# EAGLE design OSIVE IMS (EAGLE 9.0.1)
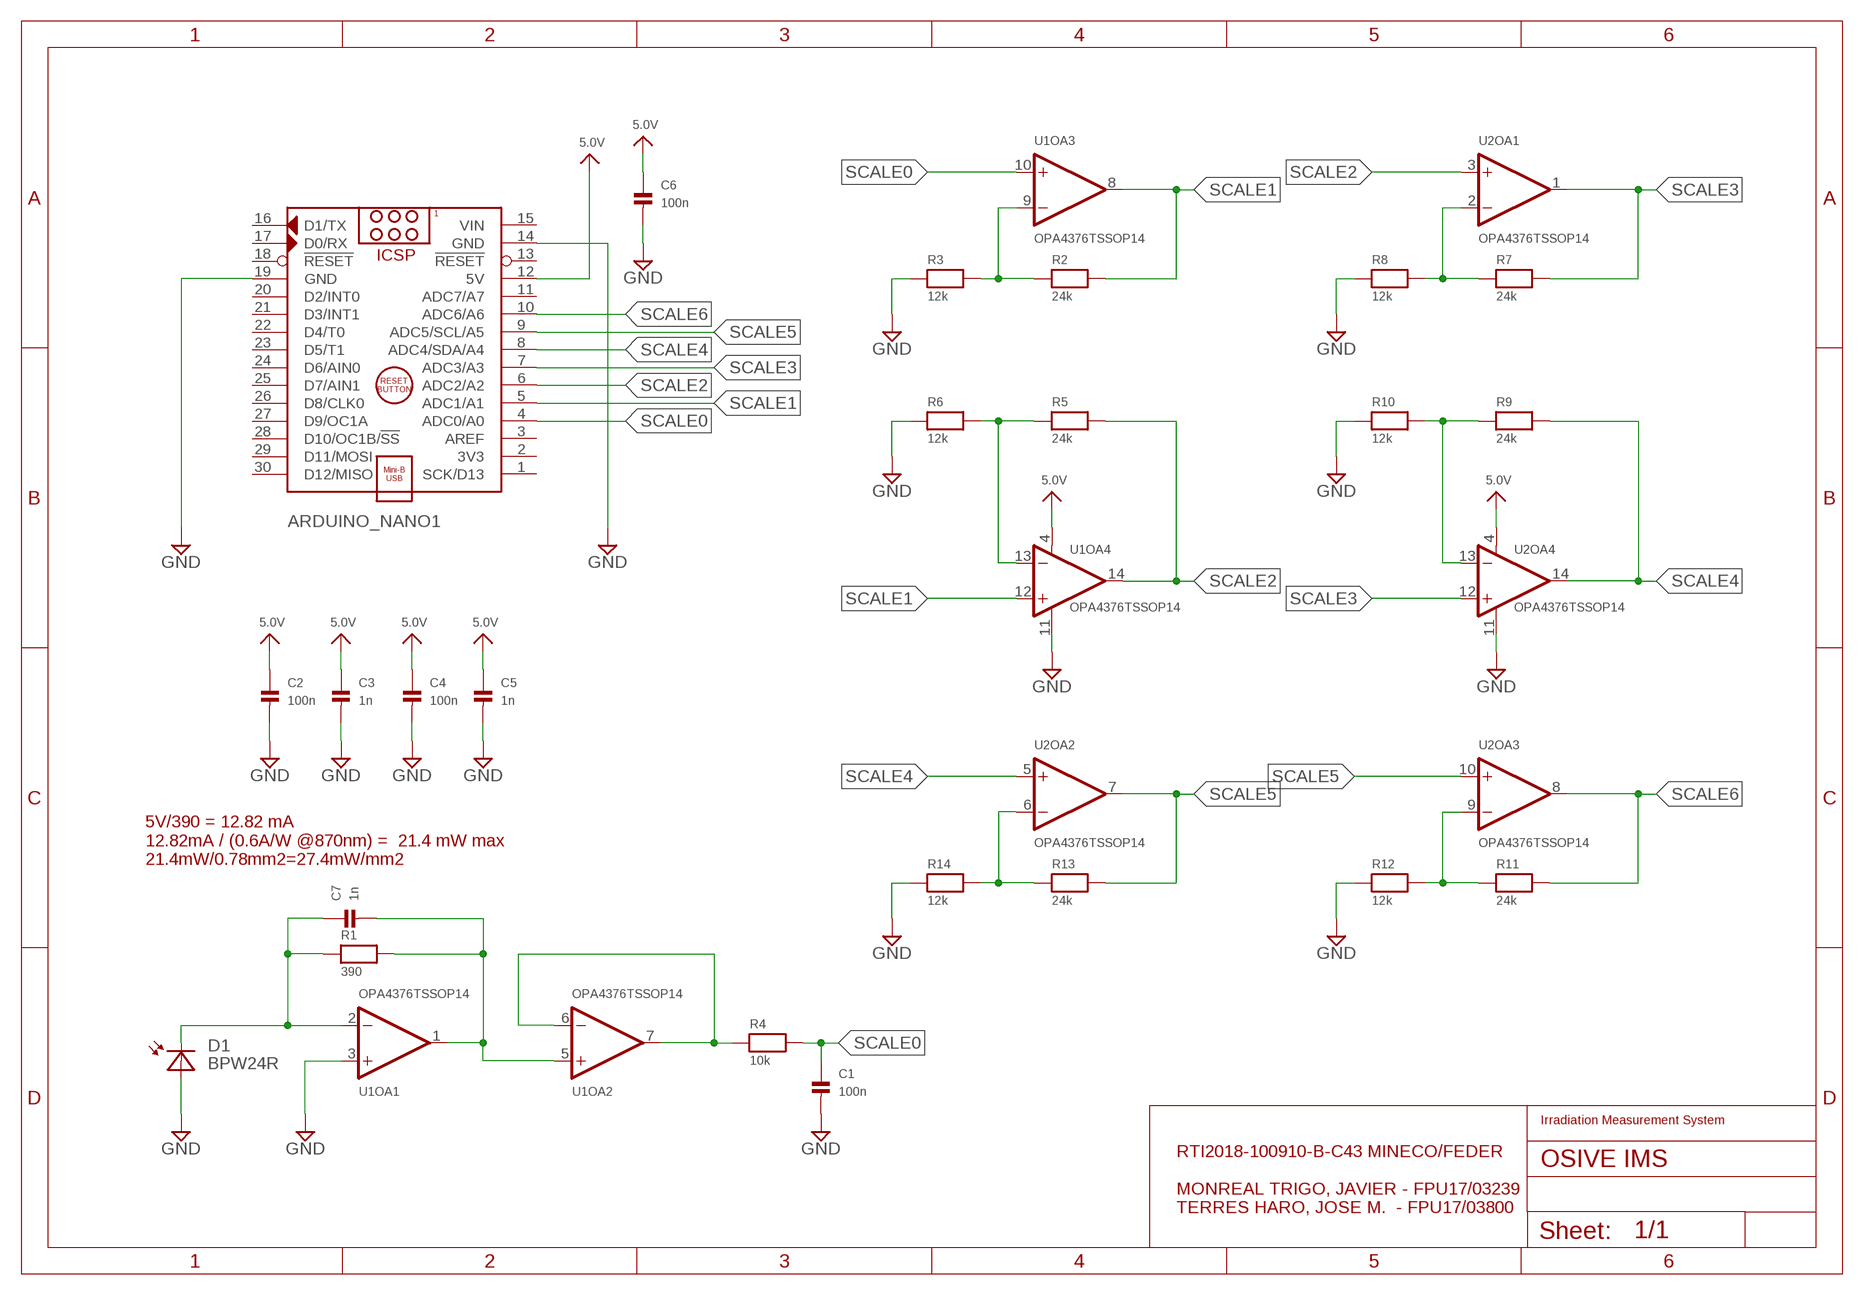
[diagram p0: schematic, sheet 1]

## Parts
ARDUINO_NANO1  ARDUINO_NANO  [ARDUINO_NANO]
C1  100n  CAP_CERAMIC0805  [0805]
C2  100n  CAP_CERAMIC0805  [0805]
C3  1n  CAP_CERAMIC0805  [0805]
C4  100n  CAP_CERAMIC0805  [0805]
C5  1n  CAP_CERAMIC0805  [0805]
C6  100n  CAP_CERAMIC0805  [0805]
C7  1n  CAP_CERAMIC0805  [0805]
D1  BPW24R  [TO-18]
R1  390  RESISTOR0805  [0805]
R2  24k  RESISTOR0805  [0805]
R3  12k  RESISTOR0805  [0805]
R4  10k  RESISTOR0805  [0805]
R5  24k  RESISTOR0805  [0805]
R6  12k  RESISTOR0805  [0805]
R7  24k  RESISTOR0805  [0805]
R8  12k  RESISTOR0805  [0805]
R9  24k  RESISTOR0805  [0805]
R10  12k  RESISTOR0805  [0805]
R11  24k  RESISTOR0805  [0805]
R12  12k  RESISTOR0805  [0805]
R13  24k  RESISTOR0805  [0805]
R14  12k  RESISTOR0805  [0805]
U1  OPA4376TSSOP14  [TSSOP14-NOTHERMALPAD]
U2  OPA4376TSSOP14  [TSSOP14-NOTHERMALPAD]

## Nets
5.0V: ARDUINO_NANO1.12(5V) C2.1 C3.1 C4.1 C5.1 C6.1 U1.4(OA4:V+) U2.4(OA4:V+)
DSNFOJW: R4.1 U1.6(OA2:-IN) U1.7(OA2:OUT)
GND: ARDUINO_NANO1.14(GND) ARDUINO_NANO1.19(GND) C1.2 C2.2 C3.2 C4.2 C5.2 C6.2 D1.A R3.1 R6.1 R8.1 R10.1 R12.1 R14.1 U1.3(OA1:+IN) U1.11(OA4:V-) U2.11(OA4:V-)
N$1: C7.1 D1.K(C) R1.1 U1.2(OA1:-IN)
N$2: R2.1 R3.2 U1.9(OA3:-IN)
N$3: C7.2 R1.2 U1.1(OA1:OUT) U1.5(OA2:+IN)
N$4: R7.1 R8.2 U2.2(OA1:-IN)
N$5: R5.1 R6.2 U1.13(OA4:-IN)
N$6: R9.1 R10.2 U2.13(OA4:-IN)
N$7: R11.1 R12.2 U2.9(OA3:-IN)
N$8: R13.1 R14.2 U2.6(OA2:-IN)
SCALE0: ARDUINO_NANO1.4(ADC0/A0) C1.1 R4.2 U1.10(OA3:+IN)
SCALE1: ARDUINO_NANO1.5(ADC1/A1) R2.2 U1.8(OA3:OUT) U1.12(OA4:+IN)
SCALE2: ARDUINO_NANO1.6(ADC2/A2) R5.2 U1.14(OA4:OUT) U2.3(OA1:+IN)
SCALE3: ARDUINO_NANO1.7(ADC3/A3) R7.2 U2.1(OA1:OUT) U2.12(OA4:+IN)
SCALE4: ARDUINO_NANO1.8(ADC4/SDA/A4) R9.2 U2.5(OA2:+IN) U2.14(OA4:OUT)
SCALE5: ARDUINO_NANO1.9(ADC5/SCL/A5) R13.2 U2.7(OA2:OUT) U2.10(OA3:+IN)
SCALE6: ARDUINO_NANO1.10(ADC6/A6) R11.2 U2.8(OA3:OUT)
Unconnected: ARDUINO_NANO1.1(SCK/D13) ARDUINO_NANO1.2(3V3) ARDUINO_NANO1.3(AREF) ARDUINO_NANO1.11(ADC7/A7) ARDUINO_NANO1.13(!RESET) ARDUINO_NANO1.16(D1/TX) ARDUINO_NANO1.17(D0/RX) ARDUINO_NANO1.18(!RESET) ARDUINO_NANO1.20(D2/INT0) ARDUINO_NANO1.21(D3/INT1) ARDUINO_NANO1.22(D4/T0) ARDUINO_NANO1.23(D5/T1) ARDUINO_NANO1.24(D6/AIN0) ARDUINO_NANO1.25(D7/AIN1) ARDUINO_NANO1.26(D8/CLK0) ARDUINO_NANO1.27(D9/OC1A) ARDUINO_NANO1.28(D10/OC1B/!SS) ARDUINO_NANO1.29(D11/MOSI) ARDUINO_NANO1.30(D12/MISO)

## Notes on the sheet
- 5V/390 = 12.82 mA
  12.82mA / (0.6A/W @870nm) =  21.4 mW max
  21.4mW/0.78mm2=27.4mW/mm2
- Irradiation Measurement System
- RTI2018-100910-B-C43 MINECO/FEDER
  
  MONREAL TRIGO, JAVIER - FPU17/03239
  TERRES HARO, JOSE M.  - FPU17/03800

## Power pins joined to a net without a drawn wire
VIN: ARDUINO_NANO1.15(VIN)

## Library data of the parts
ARDUINO_NANO1 = IrradianceMeasurement:ARDUINO_NANO: Arduino Nano V3.0 Module Overview: The Arduino Nano is a small, complete, and breadboard-friendly board based on the ATmega328 (Arduino Nano 3.x) or ATmega168 (Arduino Nano 2.x). It has more or less the same functionality of the Arduino Duemilanove, but in a different package. It lacks only a DC power jack, and works with a Mini-B USB cable instead of a standard one. The Nano was designed and is being produced by Gravitech <http://www.gravitech.us/arna30wiatp.html>. General specifications: Item Value Microcontroller Atmel ATmega168 or ATmega328 Operating Voltage (logic level) 5 V Input Voltage (recommended) 7-12 V Input Voltage (limits) 6-20 V Digital I/O Pins 14 (of which 6 provide PWM output) Analog Input Pins 8 DC Current per I/O Pin 40 mA Flash Memory 16 KB (ATmega168) or 32 KB (ATmega328) of which 2 KB used by bootloader SRAM 1 KB (ATmega168) or 2 KB (ATmega328) EEPROM 512 bytes (ATmega168) or 1 KB (ATmega328) Clock Speed 16 MHz Dimensions (Inches) 0.73" x 1.70" Dimensions (mm) 18mm x 45mm Overall height About 9 mm (not including pins) Weigth 5 g Power: The Arduino Nano can be powered via the Mini-B USB connection, 6-20V unregulated external power supply (pin 30), or 5V regulated external power supply (pin 27). The power source is automatically selected to the highest voltage source. Memory: The ATmega168 has 16 KB of flash memory for storing code (of which 2 KB is used for the bootloader); the ATmega328 has 32 KB, (also with 2 KB used for the bootloader). The ATmega168 has 1 KB of SRAM and 512 bytes of EEPROM (which can be read and written with the EEPROM library); the ATmega328 has 2 KB of SRAM and 1 KB of EEPROM. Input and Output: Each of the 14 digital pins on the Nano can be used as an input or output, using pinMode(), digitalWrite(), and digitalRead() functions. They operate at 5 volts. Each pin can provide or receive a maximum of 40 mA and has an internal pull-up resistor (disconnected by default) of 20-50 kOhms. In addition, some pins have specialized functions. Visit Arduino - ArduinoBoardNano <https://www.arduino.cc/en/Main/ArduinoBoardNano>
C1-C7 = microbuilder:CAP_CERAMIC: Ceramic Capacitors 0402 - 0402 Surface Mount Capacitors 16pF 50V 5% [Digikey: 445-4899-2-ND] 18pF 50V 5% [Digikey: 490-1281-2-ND] 22pF 50V 5% [Digikey: 490-1283-2-ND] 68pF 50V 5% [Digikey: 490-1289-2-ND] 0.1uF 10V 10% [Digikey: 490-1318-2-ND] 1.0uF 6.3V 10% [Digikey: 490-1320-2-ND] 0603 - 0603 Surface Mount Capacitors 16 pF 50V 5% [Digikey: 445-5051-2-ND] 22 pF 50V [Digikey: PCC220ACVTR-ND] 33 pF 50V 5% [Digikey: 490-1415-1-ND] 56pF 50V 5% [Digikey: 490-1421-1-ND] 220pF 50V 5% [Digikey: 445-1285-1-ND] 680 pF 50V 2200 pF 50V 5% C0G [Digikey: 445-1297-1-ND] 5600 pF 100V 5% X7R [Digikey: 478-3711-1-ND] 0.1 µF 25V 10% [Digikey: PCC2277TR-ND] 0.22 µF 16V 10% X7R [Digikey: 445-1318-1-ND] 1.0 µF 25V 10% [Digikey: 445-5146-2-ND] 0603 - RF Specific 3pF 250V +/-0.1pF RF [Digikey: 712-1347-1-ND] 18 pF 250V 5% [Digikey: 478-3505-1-ND or 712-1322-1-ND] 56 pF 250V 5% C0G RF [Digikey: 490-4867-1-ND] 68 pF 250V RF [Digikey: 490-4868-1-ND] 0805 - 0805 Surface Mount Capacitors 220 pF 250V 2% RF Ceramic Capacitor [Digikey: 712-1398-1-ND] 1000 pF 50V 2% NP0 Ceramic Capacitor [Digikey: 478-3760-1-ND] 0.1 µF 25V 10% Ceramic Capacitor [Digikey: PCC1828TR-ND] 1.0 µF 16V 10% Ceramic Capacitor[Digikey: 490-1691-2-ND] 10.0 µF 10V 10% Ceramic Capacitor[Digikey: 709-1228-1-ND] 10.0 uF 16V 10% Ceramic Capacitor [Digikey: 478-5165-2-ND] 47 uF 6.3V 20% Ceramic Capacitor [Digikey: 587-1779-1-ND or 399-5506-1-ND] 1206 - 1206 Surface Mount Capacitors 47uF 10V 20% Ceramic Capacitor [Digikey: 490-5528-1-ND or 399-5508-1-ND or 445-6010-1-ND] 100uF 6.3V -20%, +80% Y5V Ceramic Capacitor (Digikey: 490-4512-1-ND, Mouser: 81-GRM31CF50J107ZE1L)
D1 = IrradianceMeasurement:BPW24R
R1-R14 = microbuilder:RESISTOR: Resistors 0402 - 0402 Surface Mount Package 22 Ohm 1% 1/16W [Digikey: 311-22.0LRTR-ND] 33 Ohm 5% 1/16W 1.0K 5% 1/16W 1.5K 5% 1/16W 2.0K 1% 1/16W 10.0K 1% 1/16W [Digikey: 311-10.0KLRTR-ND] 10.0K 5% 1/16W [Digikey: RMCF0402JT10K0TR-ND] 12.1K 1% 1/16W [Digikey: 311-22.0LRTR-ND] 100.0K 5% 1/16W 0603 - 0603 Surface Mount Package 0 Ohm 1/10 Watt 1% Resistor 15 Ohm 1/10 Watt 1% Resistor 33 Ohm 1/10 Watt 1% Resistor 49.9 Ohm 1/10 Watt 1% Resistor 100 Ohm 1/10 Watt 1% Resistor 150 Ohm 1/10 Watt 1% Resistor 240 Ohm 1/10 Watt 1% Resistor 390 Ohm 1/10 Watt 1% Resistor 560 Ohm 1/10 Watt 1% Resistor 680 Ohm 1/10 Watt 1% Resistor 750 Ohm 1/10 Watt 1% Resistor 1.0K Ohm 1/10 Watt 1% Resistor 1.5K Ohm 1/10 Watt 1% Resistor 2.0K Ohm 1/10 Watt 1% Resistor 2.2K Ohm 1/10 Watt 1% Resistor 3.3K Ohm 1/10 Watt 1% Resistor 4.7K Ohm 1/10 Watt 1% Resistor 10.0K Ohm 1/10 Watt 1% Resistor 12.0K Ohm 1/10 Watt 1% Resistor 12.1K Ohm 1/10 Watt 1% Resistor 20.0K Ohm 1/10 Watt 1% Resistor 33.0K Ohm 1/10 Watt 1% Resistor 100.0K Ohm 1/10 Watt 1% Resistor 0805 - 0805 Surface Mount Package 0 Ohm 1/8 Watt 1% Resistor 33 Ohm 1/8 Watt 1% Resistor 100 Ohm 1/8 Watt 1% Resistor 150 Ohm 1/8 Watt 1% Resistor 200 Ohm 1/8 Watt 1% Resistor 240 Ohm 1/8 Watt 1% Resistor 330 Ohm 1/8 Watt 1% Resistor 390 Ohm 1/8 Watt 1% Resistor 470 Ohm 1/8 Watt 1% Resistor 1.0K Ohm 1/8 Watt 1% Resistor 1.5K Ohm 1/8 Watt 1% Resistor 2.0K Ohm 1/8 Watt 1% Resistor 4.7K Ohm 1/8 Watt 1% Resistor 5.1K Ohm 1/8 Watt 1% Resistor 5.6K Ohm 1/8 Watt 1% Resistor 10.0K Ohm 1/8 Watt 1% Resistor 22.0K Ohm 1/8 Watt 1% Resistor 33.0K Ohm 1/8 Watt 1% Resistor 100K Ohm 1/8 Watt 1% Resistor 1206 - 1206 Surface Mount Package 2012 - 2010 Surface Mount Package 0.11 Ohm 1/2 Watt 1% Resistor - Digikey: RHM.11UCT-ND
U1 U2 = IrradianceMeasurement:OPA4376

## Board
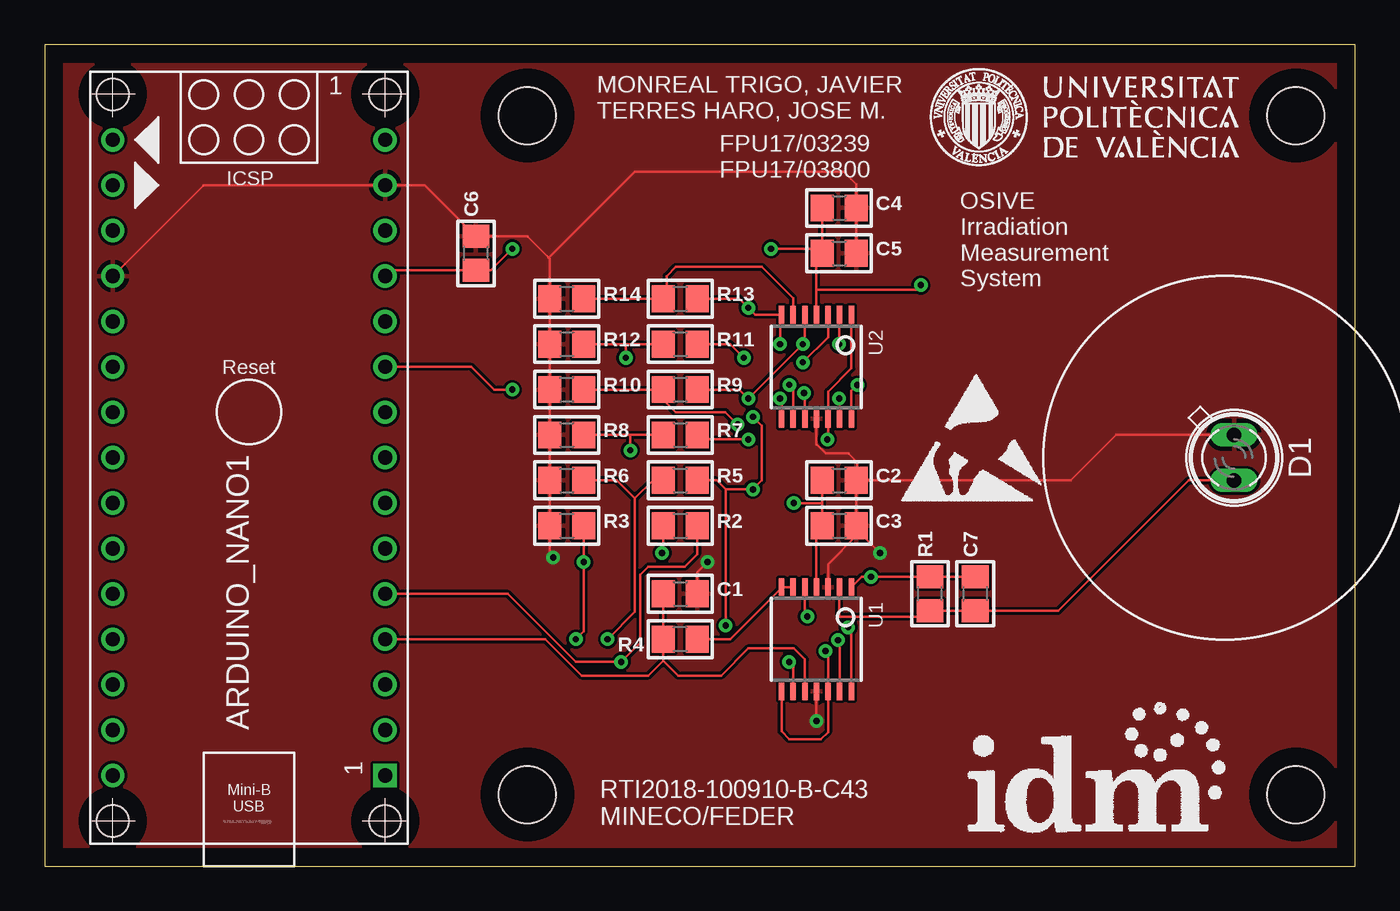
[diagram p1: board, top side]
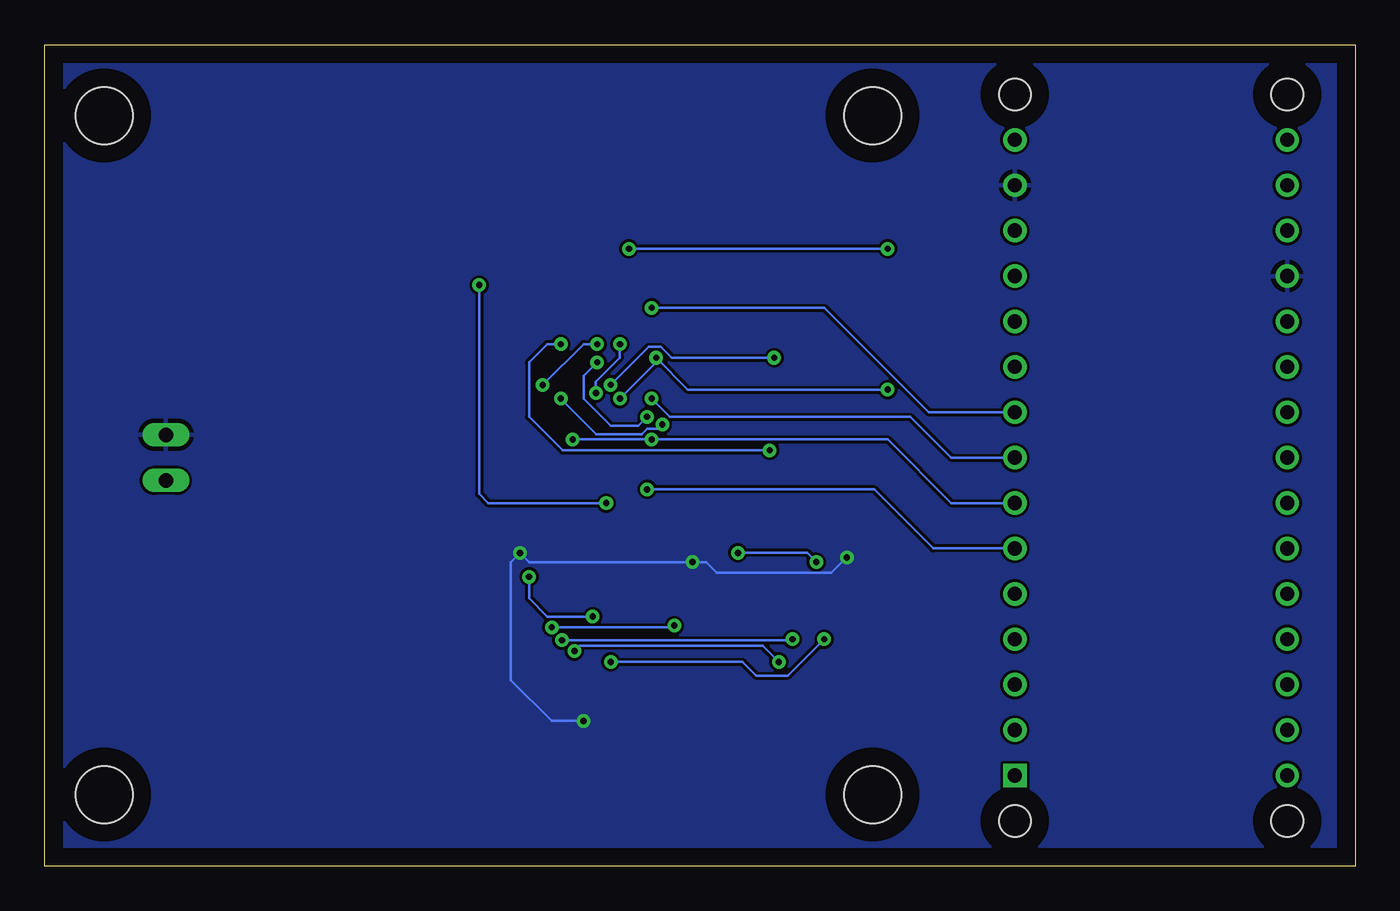
[diagram p2: board, bottom side, seen from below]

Size 73.33 x 45.96 mm. Coordinates in mm from the lower left corner, seen from the top.
Outline: 0,0 73.33,0 73.33,45.96 0,45.96 0,0
Copper layers (1*16): Top 0.035mm / dielectric 1.5mm / Bottom 0.035mm
Design rules "default": minimum track width 6mil, minimum drill 0.35mm, track to track 6mil, track to pad 6mil, pad to pad 6mil, via to via 6mil, smd to smd 6mil, copper to edge 40mil, drill to drill 6mil, minimum pad ring 10mil, minimum via ring 8mil, stop-mask expansion 4mil, vias tented up to drill 0mil, thermal gap 10mil
Holes 3.2 mm at 27,4 27,42 70,42 70,4

### Footprints (pad centres in the part's own frame; a part is rotated, then mirrored left to right if it is on the bottom)
ARDUINO_NANO = drill 0.8 square: 1 -20.32,-7.62 | drill 0.8: 2 -17.78,-7.62; 3 -15.24,-7.62; 4 -12.7,-7.62; 5 -10.16,-7.62; 6 -7.62,-7.62; 7 -5.08,-7.62; 8 -2.54,-7.62; 9 0,-7.62; 10 2.54,-7.62; 11 5.08,-7.62; 12 7.62,-7.62; 13 10.16,-7.62; 14 12.7,-7.62; 15 15.24,-7.62; 16 15.24,7.62; 17 12.7,7.62; 18 10.16,7.62; 19 7.62,7.62; 20 5.08,7.62; 21 2.54,7.62; 22 0,7.62; 23 -2.54,7.62; 24 -5.08,7.62; 25 -7.62,7.62; 26 -10.16,7.62; 27 -12.7,7.62; 28 -15.24,7.62; 29 -17.78,7.62; 30 -20.32,7.62 | hole 1.778: -22.86,-7.62; -22.86,7.62; 17.78,7.62; 17.78,-7.62
0805 = smd 1.3 x 1.5: 1 -0.95,0; 2 0.95,0
TO-18 = drill 0.813 long: A -1.27,0; K 1.27,0
TSSOP14-NOTHERMALPAD = smd 0.305 x 0.991: 1 -1.95,-2.918; 2 -1.3,-2.918; 3 -0.65,-2.918; 4 0,-2.918; 5 0.65,-2.918; 6 1.3,-2.918; 7 1.95,-2.918; 8 1.95,2.918; 9 1.3,2.918; 10 0.65,2.918; 11 0,2.918; 12 -0.65,2.918; 13 -1.3,2.918; 14 -1.95,2.918

### Placement (x,y rotation side)
ARDUINO_NANO1  11.43,25.4 90 top
C1  35.56,15.24 0 top
C2  44.45,21.59 0 top
C3  44.45,19.05 0 top
C4  44.45,36.83 0 top
C5  44.45,34.29 0 top
C6  24.13,34.29 90 top
C7  52.07,15.24 90 top
D1  66.55,22.86 270 top
R1  49.53,15.24 90 top
R2  35.56,19.05 0 top
R3  29.21,19.05 0 top
R4  35.56,12.7 180 top
R5  35.56,21.59 0 top
R6  29.21,21.59 0 top
R7  35.56,24.13 0 top
R8  29.21,24.13 0 top
R9  35.56,26.67 0 top
R10  29.21,26.67 0 top
R11  35.56,29.21 0 top
R12  29.21,29.21 0 top
R13  35.56,31.75 0 top
R14  29.21,31.75 0 top
U1  43.18,12.7 180 top
U2  43.18,27.94 180 top

### Tracks (layer width: path | path; a pad name or v marks a point on that pad's centre or on a via)
5.0V  (via drill 0.35)
  Top 0.152: U1.4 43.18,18.73 C3.1 43.5,20.32 | 43.5,20.32 C2.1 | ARDUINO_NANO1.12 19.37,33.34 C6.1 24.96,33.34 v26.16,34.54 | v40.64,34.54 43.25,34.54 C5.1 | C5.1 C4.1 | U2.4 43.18,32.26 | 43.18,32.26 43.18,33.97 C5.1 | 43.18,32.26 48.77,32.26 v49.02,32.51 | v41.91,20.32 43.5,20.32
  Bottom 0.152: v26.16,34.54 v40.64,34.54 | v49.02,32.51 49.02,20.83 48.51,20.32 v41.91,20.32
DSNFOJW
  Top 0.152: R4.1 38.35,12.7 41.15,15.49 41.23,15.58 | 41.23,15.58 U1.7 | 41.23,15.58 41.27,15.62 U1.6
GND  (via drill 0.35)
  Top 0.152: 45.4,18.8 C3.2 C2.2 45.47,21.59 | 45.4,18.8 45.4,18.48 43.83,16.91 U1.3 | 45.47,21.59 57.4,21.59 59.94,24.13 D1.A | U1.11 v43.18,8.13 | v46.74,17.53 45.47,18.8 45.4,18.8 | v37.08,17.02 36.51,16.44 C1.2 | v28.45,17.27 28.26,17.46 R3.1 R6.1 R8.1 R10.1 R12.1 | 28.19,29.72 28.26,29.65 R12.1 | R12.1 R14.1 28.26,33.97 28.19,34.04 | ARDUINO_NANO1.19 8.89,38.1 ARDUINO_NANO1.14 21.27,38.1 C6.2 26.99,35.24 28.19,34.04 | C5.2 C4.2 45.4,38.17 44.7,38.86 33.02,38.86 28.19,34.04 | U2.11 43.18,23.62 43.69,23.11 44.96,23.11 45.47,22.61 45.47,21.59
  Bottom 0.152: v43.18,8.13 44.96,8.13 47.24,10.41 47.24,17.02 v46.74,17.53 46.23,17.02 v37.08,17.02 36.32,17.02 35.72,16.41 29.31,16.41 v28.45,17.27
  pour Top: 0.25,45.97 73.41,45.97 73.41,0 0.25,0 0,-0.25 0,45.97
  pour Bottom: 0,45.97 0,0 73.41,0 73.41,45.97
N$1
  Top 0.152: U1.2 44.45,15.59 44.45,13.97 49.21,13.97 R1.1 C7.1 56.71,14.29 64.01,21.59 D1.K
N$2  (via drill 0.35)
  Top 0.152: U1.9 41.88,11.21 v41.66,11.43 | v29.72,12.7 30.16,13.14 v30.16,17.02 R3.2 | v34.54,17.53 34.61,17.59 R2.1
  Bottom 0.152: v41.66,11.43 34.29,11.43 33.53,10.67 31.75,10.67 v29.72,12.7 | v30.16,17.02 30.67,17.53 v34.54,17.53
N$3  (via drill 0.35)
  Top 0.152: U1.1 45.7,16.19 v46.23,16.19 R1.2 C7.2 | U1.5 42.53,14.11 v42.67,13.97
  Bottom 0.152: v46.23,16.19 46.23,14.99 45.21,13.97 v42.67,13.97
N$4  (via drill 0.35)
  Top 0.152: R8.2 32.77,24.13 | 32.77,24.13 R7.1 | U2.2 44.45,30.83 v44.45,29.21 | v32.77,23.27 32.77,24.13
  Bottom 0.152: v44.45,29.21 45.21,29.21 46.23,28.19 46.23,25.15 44.35,23.27 v32.77,23.27
N$5  (via drill 0.35)
  Top 0.152: U1.13 44.48,12.56 v44.39,12.64 | v31.5,12.7 33.02,14.22 33.02,20.57 | R5.1 34.04,21.59 33.02,20.57 | 33.02,20.57 32,21.59 R6.2
  Bottom 0.152: v44.39,12.64 31.55,12.64 v31.5,12.7
N$6  (via drill 0.35)
  Top 0.152: R10.2 34.54,26.67 | 34.54,26.67 R9.1 | U2.13 44.48,26.13 v44.45,26.16 | v38.77,24.71 38.09,25.4 35.31,25.4 34.54,26.16 34.54,26.67
  Bottom 0.152: v44.45,26.16 42.47,24.18 39.92,24.18 39.62,24.48 39,24.48 v38.77,24.71
N$7  (via drill 0.35)
  Top 0.152: R12.2 32.51,29.21 | 32.51,29.21 R11.1 | U2.9 41.88,26.71 v41.66,26.93 | v32.51,28.45 32.51,29.21
  Bottom 0.152: v32.51,28.45 38.26,28.45 38.87,29.05 39.54,29.05 v41.66,26.93
N$8
  Top 0.152: R14.2 R13.1 34.8,31.94 34.8,33.02 35.31,33.53 40.13,33.53 41.88,31.78 U2.6
SCALE0
  Top 0.152: C1.1 R4.2 34.61,11.5 | ARDUINO_NANO1.4 28.02,12.7 30.05,10.67 33.78,10.67 34.61,11.5 | U1.10 42.53,11.57 41.91,12.19 39.37,12.19 37.85,10.67 35.44,10.67 34.61,11.5
SCALE1  (via drill 0.35)
  Top 0.152: R2.2 36.51,17.46 35.81,16.76 33.78,16.76 33.33,16.31 33.33,12.5 v32.26,11.43 29.72,11.43 25.91,15.24 ARDUINO_NANO1.5 | v43.69,12.04 43.83,11.89 U1.12 43.83,7.51 43.43,7.11 41.66,7.11 41.23,7.54 U1.8
  Bottom 0.152: v32.26,11.43 33.17,12.34 43.39,12.34 v43.69,12.04
SCALE2  (via drill 0.35)
  Top 0.152: U1.14 45.13,13.19 v44.96,13.36 | v38.1,13.46 38.1,21.08 | R5.2 37.59,21.59 38.1,21.08 | 38.1,21.08 v39.62,21.08 40.13,21.59 40.13,24.64 v39.62,25.15 | U2.3 43.83,29.61 v42.42,28.19
  Bottom 0.152: v44.96,13.36 38.2,13.36 v38.1,13.46 | ARDUINO_NANO1.6 23.62,17.78 26.92,21.08 v39.62,21.08 | v42.42,28.19 43.18,27.43 43.18,26.16 41.66,24.64 40.13,24.64 v39.62,25.15
SCALE3  (via drill 0.35)
  Top 0.152: R7.2 36.76,23.88 v39.37,23.88 | U2.1 45.13,27.86 43.83,26.56 U2.12 43.83,23.92 v43.79,23.88
  Bottom 0.152: ARDUINO_NANO1.7 22.61,20.32 26.16,23.88 v39.37,23.88 v43.79,23.88
SCALE4  (via drill 0.35)
  Top 0.152: R9.2 38.86,26.67 v39.37,26.16 v42.42,29.21 42.53,29.32 U2.5 | U2.14 45.13,26.59 v45.47,26.92
  Bottom 0.152: v39.37,26.16 38.35,25.15 24.89,25.15 22.61,22.86 ARDUINO_NANO1.8 | v45.47,26.92 43.18,29.21 v42.42,29.21
SCALE5  (via drill 0.35)
  Top 0.152: R13.2 38.86,31.75 v39.37,31.24 39.75,30.86 U2.7 41.15,30.78 v41.15,29.21 | U2.10 42.53,26.43 v42.49,26.47
  Bottom 0.152: v39.37,31.24 29.72,31.24 23.88,25.4 ARDUINO_NANO1.9 | v42.49,26.47 42.49,27.11 41.15,28.45 v41.15,29.21
SCALE6  (via drill 0.35)
  Top 0.152: R11.2 38.35,29.21 v39.12,28.45 | v26.16,26.67 25.15,26.67 23.88,27.94 ARDUINO_NANO1.10 | U2.8 41.23,26.08 v41.15,26.16
  Bottom 0.152: v26.16,26.67 37.34,26.67 v39.12,28.45 39.12,28.19 v41.15,26.16

### Text on the board
tPlace: MONREAL TRIGO, JAVIER / TERRES HARO, JOSE M. | FPU17/03239 / FPU17/03800 | OSIVE / Irradiation / Measurement / System | RTI2018-100910-B-C43 / MINECO/FEDER